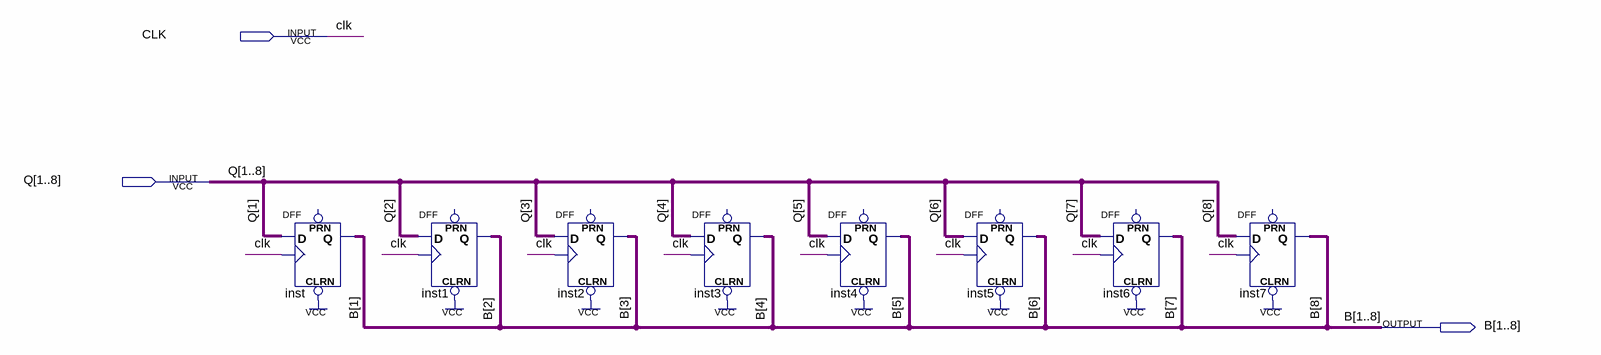
[diagram p0: schematic sheet]
// Quartus schematic Acumulador.bdf as structural Verilog: 8 symbols, 3 pins
module Acumulador (
  input  CLK,
  input  [1:8] Q,
  output [1:8] B
);

  DFF inst (.CLRN(1'b1), .CLK(CLK), .D(Q[1]), .Q(B[1]));  // open: PRN
  DFF inst1 (.CLRN(1'b1), .CLK(CLK), .D(Q[2]), .Q(B[2]));  // open: PRN
  DFF inst2 (.CLRN(1'b1), .CLK(CLK), .D(Q[3]), .Q(B[3]));  // open: PRN
  DFF inst3 (.CLRN(1'b1), .CLK(CLK), .D(Q[4]), .Q(B[4]));  // open: PRN
  DFF inst4 (.CLRN(1'b1), .CLK(CLK), .D(Q[5]), .Q(B[5]));  // open: PRN
  DFF inst5 (.CLRN(1'b1), .CLK(CLK), .D(Q[6]), .Q(B[6]));  // open: PRN
  DFF inst6 (.CLRN(1'b1), .CLK(CLK), .D(Q[7]), .Q(B[7]));  // open: PRN
  DFF inst7 (.CLRN(1'b1), .CLK(CLK), .D(Q[8]), .Q(B[8]));  // open: PRN
endmodule
